# EAGLE design proximity_pcb_thin (EAGLE 5.10)
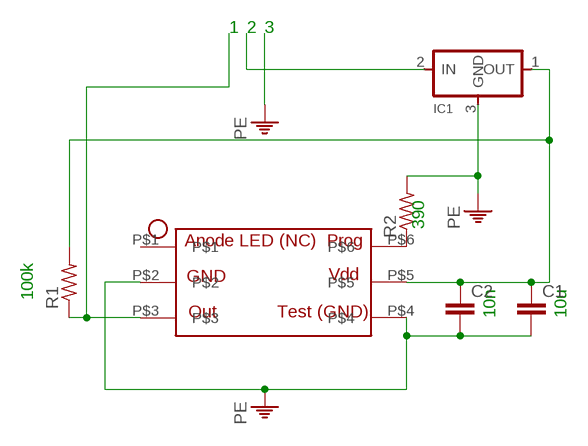
[diagram p0: schematic, sheet 1]

## Parts
C1  C-EUC0603  [C0603]
C2  C-EUC0603  [C0603]
IC1  REGULATORSOT23  [SOT23]
R1  R-US_R0603  [R0603]
R2  R-US_R0603  [R0603]
U$1  SFH7741  [SFH7741-SMD]

## Nets
N$1: C1.1 C2.1 IC1.1(OUT) R1.2 U$1.P$5
N$2: IC1.2(IN)
N$3: R1.1 U$1.P$3
N$4: R2.1 U$1.P$6
PE: C1.2 C2.2 IC1.3(GND) R2.2 U$1.P$2 U$1.P$4
Unconnected: U$1.P$1

## Notes on the sheet
- 1 | 2 | 3
- 390
- 100k
- 10n | 10u

## Library data of the parts
C1 C2 = rcl:C-EU: CAPACITOR, European symbol
IC1 = ng:REGULATOR
R1 R2 = resistor:R-US_: RESISTOR, American symbol
U$1 = rfc:SFH7741: 3.6 V IR proximity sensor. SMD

## Board
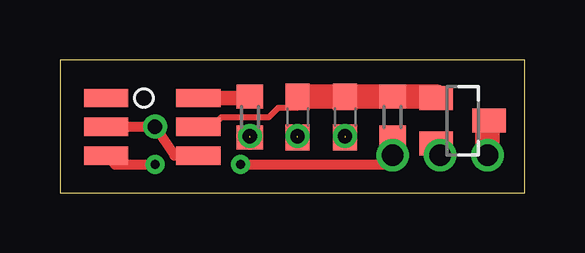
[diagram p1: board, top side]
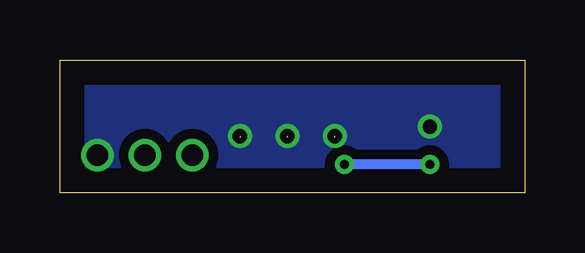
[diagram p2: board, bottom side, seen from below]

Size 19.39 x 5.56 mm. Coordinates in mm from the lower left corner, seen from the top.
Outline: 0,0 19.39,0 19.39,5.56 0,5.56 0,0
Copper layers (1*16): Top 0.035mm / dielectric 1.5mm / Bottom 0.035mm
Design rules "default *": minimum track width 10mil, minimum drill 24mil, track to track 16mil, track to pad 16mil, pad to pad 16mil, via to via 16mil, smd to smd 16mil, copper to edge 40mil, drill to drill 8mil, minimum pad ring 10mil, minimum via ring 8mil, stop-mask expansion 4mil, vias tented up to drill 0mil, thermal gap 10mil

### Footprints (pad centres in the part's own frame; a part is rotated, then mirrored left to right if it is on the bottom)
C0603 = smd 1.1 x 1: 1 -0.85,0; 2 0.85,0
SOT23 = smd 1 x 1.4: 1 -0.95,-1.1; 2 0.95,-1.1; 3 0,1.1
R0603 = smd 1 x 1.1: 1 -0.85,0; 2 0.85,0
SFH7741-SMD = smd 1.85 x 0.762: P$1 -0.3,0; P$2 -0.3,-1.2; P$3 -0.3,-2.4; P$4 3.55,-2.4; P$5 3.55,-1.2; P$6 3.55,0

### Placement (x,y rotation side)
C1  9.91,3.17 270 top
C2  11.89,3.17 270 top
IC1  16.79,3.02 270 top
R1  13.87,3.17 90 top
R2  7.92,3.17 270 top
U$1  2.23,3.96 0 top

### Tracks (layer width: path | path; a pad name or v marks a point on that pad's centre or on a via)
N$1
  Top 0.254: C1.1 9.91,3.57 9.11,3.57 8.72,3.17 6.74,3.17 6.33,2.76 U$1.P$5
  Top 1.016: C1.1 C2.1 R1.2 15.69,4.02 IC1.1
N$2  (via drill 0.9)
  Top 1.016: IC1.2 15.85,2.07 v15.85,1.58
N$3  (via drill 0.38, 0.9)
  Top 0.406: U$1.P$3 2.3,1.19 v3.96,1.19 | v7.53,1.19 13.87,1.19 | 13.87,1.19 | 13.87,1.19 v13.87,1.58
  Top 1.016: R1.1 | v13.87,1.58 R1.1
  Bottom 0.406: v3.96,1.19 v7.53,1.19
N$4
  Top 0.61: R2.1 7.87,3.96 U$1.P$6
N$9  (via drill 0.38)
  other vias: 7.53,1.19
N$10  (via drill 0.38)
  other vias: 3.96,1.19
PE  (via drill 0.6, 0.9)  (3 unrouted)
  Top 0.406: U$1.P$2 1.94,2.77 v3.96,2.77 4.78,1.56 U$1.P$4
  Top 1.016: IC1.3 17.83,3.02 v17.83,1.58
  other vias: 7.92,2.38 9.91,2.38 11.89,2.38
  pour Bottom: 19.42,5.55 19.42,0 7.92,0 7.92,1.58 3.57,1.58 3.57,0 0,0 0,5.55